# Altium schematic sheet Microcontroller and Power Management.SchDoc
size A4; SheetNumber: 1; SheetTotal: 4
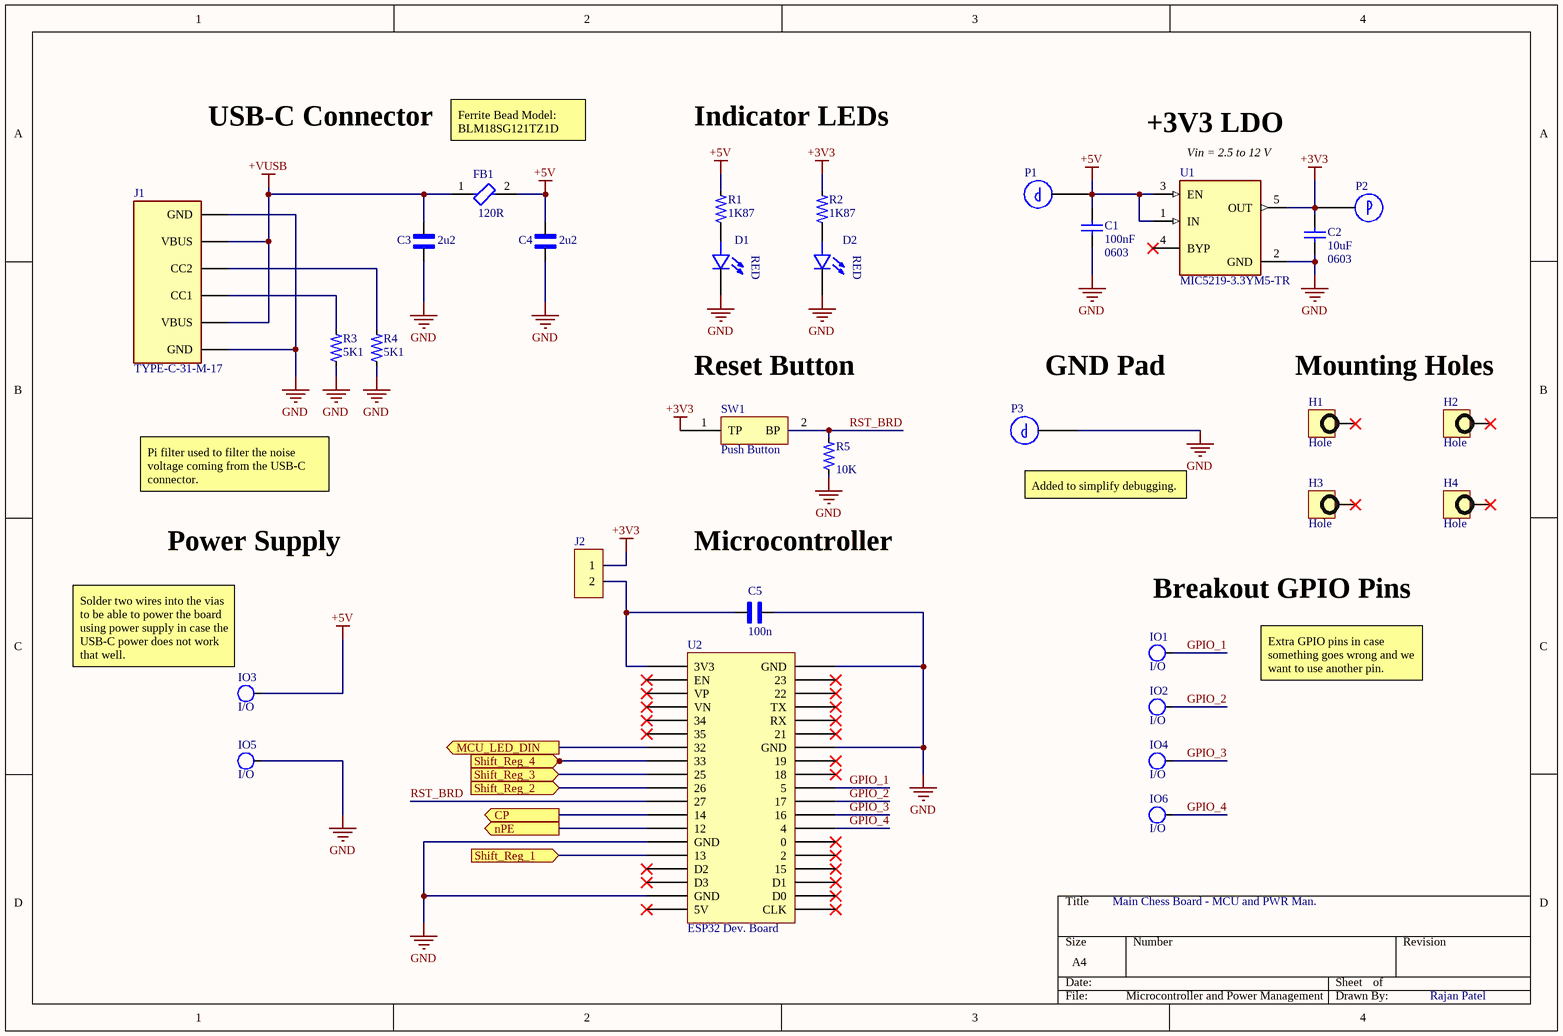
[diagram p0: Microcontroller and Power Management.SchDoc]

## Parts
C1  100nF  value 0603  [CAP 0805]
C2  10uF  value 0603  [CAP 0805]
C3  2u2  [CAP 0805]
C4  2u2  [CAP 0805]
C5  100n  [CAP 0805]
D1  LED 0805  [LED_0805]  (value not drawn)
D2  LED 0805  [LED_0805]  (value not drawn)
FB1  120R  [FP-BLM21-0_2-t0_85-e0_5-IPC_A]
H1  Hole  [M3 Holes]
H2  Hole  [M3 Holes]
H3  Hole  [M3 Holes]
H4  Hole  [M3 Holes]
IO1  I/O  [I/O]
IO2  I/O  [I/O]
IO3  I/O  [I/O]
IO4  I/O  [I/O]
IO5  I/O  [I/O]
IO6  I/O  [I/O]
J1  TYPE-C-31-M-17  [TYPEC31M17]
J2  2 Pin Male Header  [2 Pin Male Header]  (value not drawn)
P1  Probe_5019  [Testpoint]  (value not drawn)
P2  Probe_5019  [Testpoint]  (value not drawn)
P3  Probe_5019  [Testpoint]  (value not drawn)
R1  1K87  [res 0805]
R2  1K87  [res 0805]
R3  5K1  [res 0805]
R4  5K1  [res 0805]
R5  10K  [res 0805]
SW1  Push Button  [Push Button]
U1  MIC5219-3.3YM5-TR  [FP-SOT23-5LD-PL-1-IPC_C]
U2  ESP32 Dev. Board  [ESPRESSIF_ESP32-DEVKITC-32UE]

## Ports
CP (out, see Shift Registers[1A]), MCU_LED_DIN (out, see WS2812B[1B]), nPE (out, see Shift Registers[1A]), Shift_Reg_1 (in, see Shift Registers[2B]), Shift_Reg_2 (in, see Shift Registers[4B]), Shift_Reg_3 (in, see Shift Registers[2C]), Shift_Reg_4 (in, see Shift Registers[4C])

## Nets
+3V3: C2.2 J2.1 P2.1 R2.2 SW1.1(TP) U1.5(OUT)
+5V: C1.2 C4.2 FB1.2 IO3.1 P1.1 R1.2 U1.1(IN) U1.3(EN)
+VUSB: C3.2 FB1.1 J1.2(VBUS) J1.5(VBUS)
GND: C1.1 C2.1 C3.1 C4.1 C5.1 D1.1(C) D2.1(C) IO5.1 J1.1(GND) J1.6(GND) P3.1 R3.1 R4.1 R5.1 U1.2(GND) U2.14(GND) U2.18(GND) U2.32(GND) U2.38(GND)
CP: U2.12(14) ; port CP
GPIO_1: IO1.1 U2.29(5)
GPIO_2: IO2.1 U2.28(17)
GPIO_3: IO4.1 U2.27(16)
GPIO_4: IO6.1 U2.26(4)
MCU_LED_DIN: U2.7(32) ; port MCU_LED_DIN
nPE: U2.13(12) ; port nPE
RST_BRD: R5.2 SW1.2(BP) U2.11(27)
Shift_Reg_1: U2.15(13) ; port Shift_Reg_1
Shift_Reg_2: U2.10(26) ; port Shift_Reg_2
Shift_Reg_3: U2.9(25) ; port Shift_Reg_3
Shift_Reg_4: U2.8(33) ; port Shift_Reg_4
NetC5_2: C5.2 J2.2 U2.1(3V3)
NetD1_2: D1.2(A) R1.1
NetD2_2: D2.2(A) R2.1
NetJ1_3: J1.3(CC1) R3.2
NetJ1_4: J1.4(CC2) R4.2

Not connected (* = marked no-connect by the designer): H1 1(TERMINAL)*; H2 1(TERMINAL)*; H3 1(TERMINAL)*; H4 1(TERMINAL)*; U1 4(BYP)*; U2 2(EN)* 3(VP)* 4(VN)* 5(34)* 6(35)* 16(D2)* 17(D3)* 19(5V)* 20(CLK)* 21(D0)* 22(D1)* 23(15)* 24(2)* 25(0)* 30(18)* 31(19)* 33(21)* 34(RX)* 35(TX)* 36(22)* 37(23)*

## Notes on the sheet
- USB-C Connector
- Ferrite Bead Model: BLM18SG121TZ1D
- Indicator LEDs
- +3V3 LDO
- (near U1) Vin = 2.5 to 12 V
- Reset Button
- (near P3) GND Pad
- Mounting Holes
- Pi filter used to filter the noise voltage coming from the USB-C connector.
- (near P3) Added to simplify debugging.
- Power Supply
- Microcontroller
- Breakout GPIO Pins
- (near IO3) Solder two wires into the vias to be able to power the board using power supply in case the USB-C power does not work that well.
- Extra GPIO pins in case something goes wrong and we want to use another pin.
- Main Chess Board - MCU and PWR Man.
- Rajan Patel
- (in symbol LED 0805) RED

## Library data of the parts
C1 C2 = Cap: Capacitor; Published: 8-Jun-2000; LatestRevisionDate: 17-Jul-2002; LatestRevisionNote: Re-released for DXP Platform.; PackageReference: RAD-0.3; Publisher: Altium Limited; PackageDescription: Radial Cap, Thru-Hole; 2 Leads; 0.3 in Pin Spacing
C3-C5 = CAP 0805: SnapEDA_Link: https://www.snapeda.com/parts/C2012X8R1H104K125AA/TDK/view-part/?ref=snap; Check_prices: https://www.snapeda.com/parts/C2012X8R1H104K125AA/TDK/view-part/?ref=eda; Value: *
D1 D2 = LED 0805: Red LED Indication - Discrete 1.7V 0805 (2012 Metric); MP: 7012X1; Package: None; Availability: Unavailable; Value: *; Price: None
FB1 = CMP-0686-00716-3: FERRITE BEAD 120 OHM 0603 1LN; Number of Lines: 1; DC Resistance-Max: 100mR; Material: Steel; Max DC Current: 200mA; Shielding: Unshielded; Test Frequency: 100MHz; Current Rating: 800mA; Max Current Rating: 1A; Resistance: 150mR; Tolerance: 25%; Width: 1.25mm; Number of Circuits: 1; Military Standard: Not; Height: 0.85mm; Series: BLM21A; Min Operating Temperature: -55°C; DC Resistance (DCR): 100mR; Termination: SMD/SMT; Impedance: 120R; Core Material: Ferrite; REACH SVHC: No SVHC; Radiation Hardening: No; Max Operating Temperature: 125°C; Number of Pins: 2; Case/Package: 0805; Case Code (Imperial): 0805; Frequency: 100MHz; Depth: 1.25mm; Length: 2mm; DC Current: 200mA; Lead Free: Lead Free; Case Code (Metric): 2012; Package Quantity: 1; Packaging: Tape and Reel
J1 = TYPE-C-31-M-17: TYPE-C-31-M-17 HROPARTS; MF: HRO Electronics Co., Ltd.; SnapEDA_Link: https://www.snapeda.com/parts/TYPE-C-31-M-17/HRO+Electronics+Co.%252C+Ltd./view-part/?ref=snap; Package: Package; Value: *; MP: TYPE-C-31-M-17; Check_prices: https://www.snapeda.com/parts/TYPE-C-31-M-17/HRO+Electronics+Co.%252C+Ltd./view-part/?ref=eda
J2 = 2 Pin Male Header: Board Connector, 2 Contact(s), 1 Row(s), Male, Straight, 0.1 inch Pitch, Solder Terminal, Black Insulator, Receptacle; Manufacturer: TE Connectivity; Manufacturer Part Number: 5-146277-2; Option: General Purpose; Contact Pattern: RECTANGULAR; Contact Style: SQ PIN-SKT; Filter Feature: No; Number Of Connectors: 1; Number of Contacts: 2; Body Breadth: 0.092inch; Body Depth: 0.09inch; Body Length: 0.184inch; Plating Thickness: 30uin; Reference Standard: UL; Reliability: COMMERCIAL; Supplier: Digikey; Supplier Part Number: A121371-ND; RoHS: Yes; Category: Connectors; Stock: 17660; Pricing: 1=0.41, 10=0.372, 100=0.3099, 500=0.2634, 1000=0.23087, 5000=0.20608, 10000=0.19176 (USD); Mounting Technology: Board; Contact Finish - Mating: MATTE TIN; Contact Finish - Termination: MATTE TIN; Insulation Color: Black; Insulation Material: Polymer; Connector Type: BOARD CONNECTOR; JESD-609 Code: e3; Body/Shell Style: RECEPTACLE; Contact Gender: Male; Mixed Contacts: No; Mounting Style: STRAIGHT; Number Of PCB Rows: 1; Number of Rows Loaded: 1; PCB Contact Pattern: RECTANGULAR; Termination: Solder; Mating Contact Pitch: 0.1inch; Terminal Length: 0.125inch; Terminal Pitch: 2.54mm; DIN Conformance: No; IEC Conformance: No; MIL Conformance: No; Reach SVHC Compliant: Yes; RoHS Compliant: Yes; ComponentLink1URL: https://datasheet.ciiva.com:443/pdfs/VipMasterIC/IC/TYEL/TYEL-L-A0003497673/TYEL-S-A0000657051-1.pdf?src-supplier=IHS+Markit; ComponentLink1Description: https://datasheet.ciiva.com:443/pdfs/VipMasterIC/IC/TYEL/TYEL-L-A0003497673/TYEL-S-A0000657051-1.pdf?src-supplier=IHS+Markit; ComponentLink2URL: https://datasheet.ciiva.com/22660/1537112-22660377.pdf?src-supplier=Element14; ComponentLink2Description: https://datasheet.ciiva.com/22660/1537112-22660377.pdf?src-supplier=Element14; ComponentLink3URL: https://datasheet.ciiva.com/717/eng-cd-146277-h-146277-1-c-dwg-717333.pdf?src-supplier=Digikey; ComponentLink3Description: https://datasheet.ciiva.com/717/eng-cd-146277-h-146277-1-c-dwg-717333.pdf?src-supplier=Digikey; ComponentLink4URL: https://datasheet.ciiva.com/16426/eng-cd-146277-g2-16426389.pdf?src-supplier=Future+Electronics; ComponentLink4Description: https://datasheet.ciiva.com/16426/eng-cd-146277-g2-16426389.pdf?src-supplier=Future+Electronics; ComponentLink5URL: https://datasheet.ciiva.com/30096/146277-30096236.pdf?src-supplier=Onlinecomponents.com; ComponentLink5Description: https://datasheet.ciiva.com/30096/146277-30096236.pdf?src-supplier=Onlinecomponents.com
P1-P3 = Probe_5019: Phosphor Bronze Contact Miniature Silver Plated Surface Mount Test Points; Manufacturer: Keystone Electronics; Manufacturer Part Number: 5019; Supplier 1: Newark; RoHS: Yes; Category: Connectors; Stock 1: 148000; Pricing 1: 1=0.12300, 1000=0.12300, 2000=0.11700, 4000=0.11300, 6000=0.11000 (USD); Mount: Surface Mount,PCB; Number of Pins: 1; Contact Plating: Silver; Contact Material: Bronze; Material: Bronze; Plating: Silver; Body Material: Bronze; Packaging: Tape and Reel; Package Quantity: 1; Termination: SMD/SMT; Series: 5019; Height: 0.09inch; RoHS Compliant: Yes; Lead Free: Lead Free; Reach SVHC Compliant: Yes; ComponentLink1URL: https://datasheet.ciiva.com/16318/m60-2p61-16318395.pdf?src-supplier=Future+Electronics; ComponentLink1Description: https://datasheet.ciiva.com/16318/m60-2p61-16318395.pdf?src-supplier=Future+Electronics; ComponentLink2URL: https://datasheet.ciiva.com/16885/70182998-16885945.pdf?src-supplier=Allied+Electronics; ComponentLink2Description: https://datasheet.ciiva.com/16885/70182998-16885945.pdf?src-supplier=Allied+Electronics; ComponentLink3URL: https://datasheet.ciiva.com/14848/m60-2p61-14848437.pdf?src-supplier=Digi-Key; ComponentLink3Description: https://datasheet.ciiva.com/14848/m60-2p61-14848437.pdf?src-supplier=Digi-Key; ComponentLink4URL: https://datasheet.ciiva.com/14848/m60-2p61-14848438.pdf?src-supplier=Digi-Key; ComponentLink4Description: https://datasheet.ciiva.com/14848/m60-2p61-14848438.pdf?src-supplier=Digi-Key; ComponentLink5URL: https://datasheet.ciiva.com/14848/m60-2p61-14848439.pdf?src-supplier=Digi-Key; ComponentLink5Description: https://datasheet.ciiva.com/14848/m60-2p61-14848439.pdf?src-supplier=Digi-Key; Supplier Part Number 1: 06W4636
R1-R5 = Resistor 0805: MP: 2-2176053-2; Resistance: .39; Power_Rating: .25 W; MF: TE Connectivity; Tolerance: 1%; Package: 0805; Value: *; SnapEDA_Link: https://www.snapeda.com/parts/2-2176053-2/TE%20Connectivity/view-part/2214511/?ref=snap; Availability: Unavailable; Price: None; EU_RoHS_Compliance: Compliant with Exemptions
U1 = CMP-06324-000027-1: IC REG LINEAR 3.3V 500MA SOT23-5; Dropout Voltage: 350mV; Output Type: Fixed; Number of Regulators: 1; Max Input Voltage: 12V; Min Input Voltage: 2.5V; Min Operating Temperature: -40°C; Nominal Output Voltage: 3.3V; Output Voltage: 3.3V; Packaging: Cut Tape; Mount: Surface Mount; Number of Pins: 5; Case/Package: SOT-23-5; Lead Free: Lead Free; Max Operating Temperature: 125°C; REACH SVHC: No SVHC; Output Current: 500mA
U2 = ESP32 Dev. Board: ESP32-WROOM-32UE Series Evaluation Board 802.11 b/g/n (WiFi, WLAN) Bluetooth Smart Ready 4.x Dual Mode; Manufacturer: Espressif Systems; Manufacturer Part Number: ESP32-DEVKITC-32UE; Supplier: Digikey; Supplier Part Number: 1965-ESP32-DEVKITC-32UE-ND; RoHS: No; Category: RF Semiconductors and Devices; Stock: 498; Pricing: 1=10 (USD); ComponentLink1URL: https://www.espressif.com/sites/default/files/documentation/espressif_products_ordering_information_en.pdf?src-supplier=Digikey; ComponentLink1Description: https://www.espressif.com/sites/default/files/documentation/espressif_products_ordering_information_en.pdf?src-supplier=Digikey; ComponentLink2URL: https://datasheet.octopart.com/ESP32-DEVKITC-32UE-Espressif-Systems-datasheet-165560559.pdf?src-supplier=TME; ComponentLink2Description: https://datasheet.octopart.com/ESP32-DEVKITC-32UE-Espressif-Systems-datasheet-165560559.pdf?src-supplier=TME